# Altium schematic sheet euromap.SchDoc: EUROMAP interface
size A2; DrawnBy: Sergey Dytiuk (Ulysses); Engineer: Sergey Dytiuk; DocumentNumber: UCNC.01.00.001; SheetNumber: 1; SheetTotal: 1
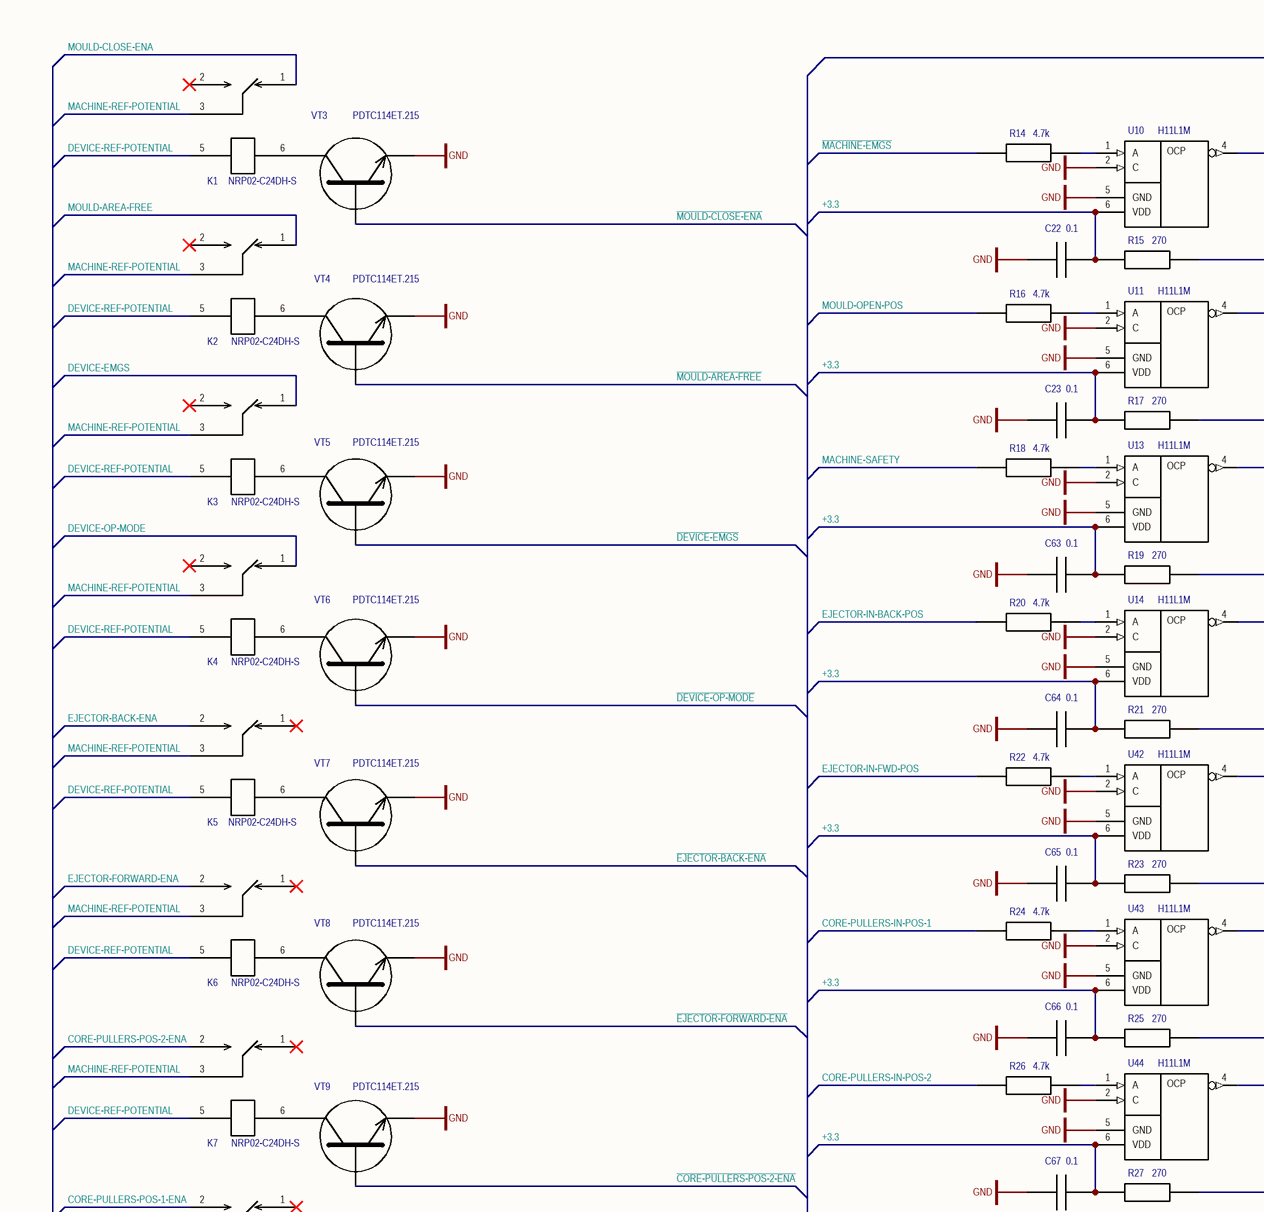
[diagram p0: euromap.SchDoc, top left]
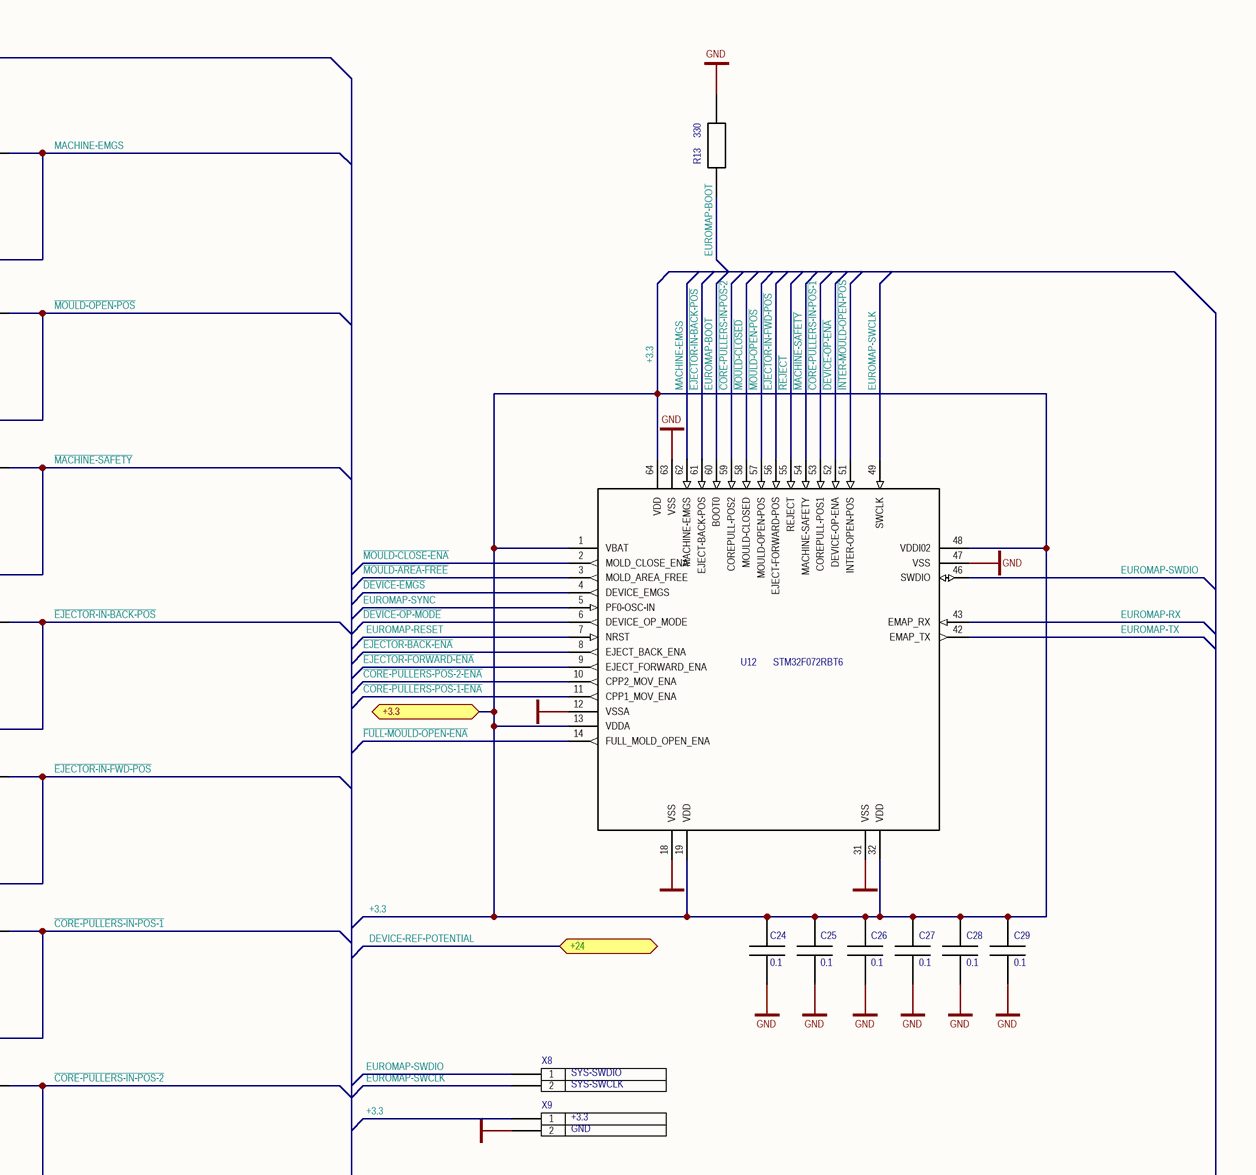
[diagram p1: euromap.SchDoc, top right]
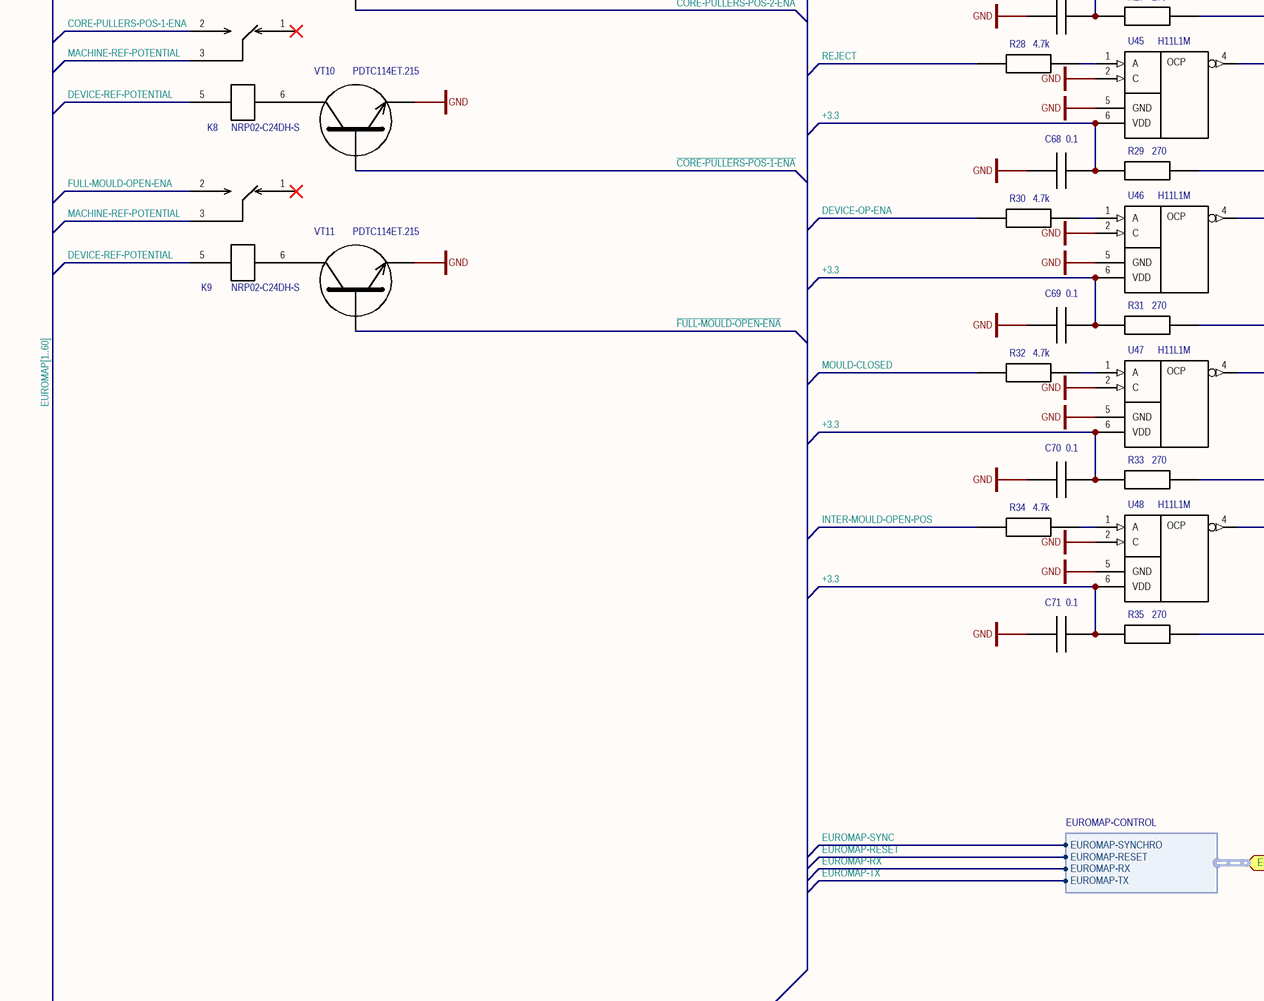
[diagram p2: euromap.SchDoc, bottom left]
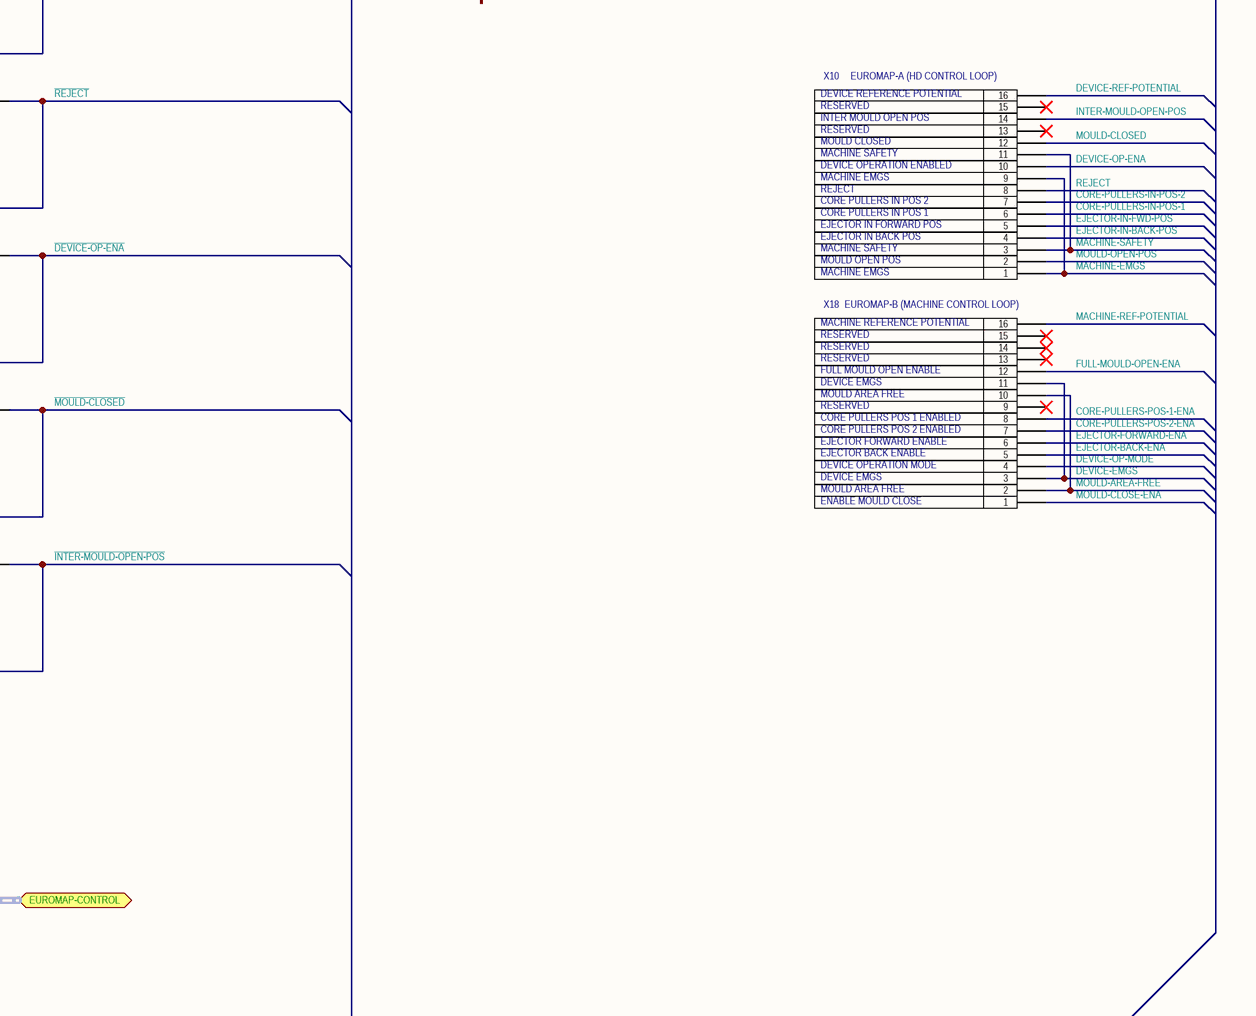
[diagram p3: euromap.SchDoc, bottom right]

## Parts
C22  0.1  [CAPC2012X04N]
C23  0.1  [CAPC2012X04N]
C24  0.1  [CAPC1608X05N]
C25  0.1  [CAPC1608X05N]
C26  0.1  [CAPC1608X05N]
C27  0.1  [CAPC1608X05N]
C28  0.1  [CAPC1608X05N]
C29  0.1  [CAPC1608X05N]
C63  0.1  [CAPC2012X04N]
C64  0.1  [CAPC2012X04N]
C65  0.1  [CAPC2012X04N]
C66  0.1  [CAPC2012X04N]
C67  0.1  [CAPC2012X04N]
C68  0.1  [CAPC2012X04N]
C69  0.1  [CAPC2012X04N]
C70  0.1  [CAPC2012X04N]
C71  0.1  [CAPC2012X04N]
K1  NRP02-C24DH-S  [R_NRP02]
K2  NRP02-C24DH-S  [R_NRP02]
K3  NRP02-C24DH-S  [R_NRP02]
K4  NRP02-C24DH-S  [R_NRP02]
K5  NRP02-C24DH-S  [R_NRP02]
K6  NRP02-C24DH-S  [R_NRP02]
K7  NRP02-C24DH-S  [R_NRP02]
K8  NRP02-C24DH-S  [R_NRP02]
K9  NRP02-C24DH-S  [R_NRP02]
R13  330  [RESC1608X05N]
R14  4.7k  [RESC2012X04N]
R15  270  [RESC2012X04N]
R16  4.7k  [RESC2012X04N]
R17  270  [RESC2012X04N]
R18  4.7k  [RESC2012X04N]
R19  270  [RESC2012X04N]
R20  4.7k  [RESC2012X04N]
R21  270  [RESC2012X04N]
R22  4.7k  [RESC2012X04N]
R23  270  [RESC2012X04N]
R24  4.7k  [RESC2012X04N]
R25  270  [RESC2012X04N]
R26  4.7k  [RESC2012X04N]
R27  270  [RESC2012X04N]
R28  4.7k  [RESC2012X04N]
R29  270  [RESC2012X04N]
R30  4.7k  [RESC2012X04N]
R31  270  [RESC2012X04N]
R32  4.7k  [RESC2012X04N]
R33  270  [RESC2012X04N]
R34  4.7k  [RESC2012X04N]
R35  270  [RESC2012X04N]
U10  H11L1M  [DIP6]
U11  H11L1M  [DIP6]
U12  STM32F072RBT6  [TSQFP50P1200X1200X160-64N]
U13  H11L1M  [DIP6]
U14  H11L1M  [DIP6]
U42  H11L1M  [DIP6]
U43  H11L1M  [DIP6]
U44  H11L1M  [DIP6]
U45  H11L1M  [DIP6]
U46  H11L1M  [DIP6]
U47  H11L1M  [DIP6]
U48  H11L1M  [DIP6]
VT3  PDTC114ET.215  [SOT95P238X102-3N]
VT4  PDTC114ET.215  [SOT95P238X102-3N]
VT5  PDTC114ET.215  [SOT95P238X102-3N]
VT6  PDTC114ET.215  [SOT95P238X102-3N]
VT7  PDTC114ET.215  [SOT95P238X102-3N]
VT8  PDTC114ET.215  [SOT95P238X102-3N]
VT9  PDTC114ET.215  [SOT95P238X102-3N]
VT10  PDTC114ET.215  [SOT95P238X102-3N]
VT11  PDTC114ET.215  [SOT95P238X102-3N]
X8  Jamper ZL201  [ZL201-2]  (value not drawn)
X9  Jamper ZL201  [ZL201-2]  (value not drawn)
X10  EUROMAP-A (HD CONTROL LOOP)  [MINI-FIT-16-WAY-M]
X18  EUROMAP-B (MACHINE CONTROL LOOP)  [MINI-FIT-16-WAY-M]

## Ports
+3.3, +24, EUROMAP-CONTROL (harness EUROMAP-CONTROL)

## Harnesses
EUROMAP-CONTROL: EUROMAP-SYNCHRO, EUROMAP-RESET, EUROMAP-RX, EUROMAP-TX

## Nets
GND: C22.1 C23.1 C24.1 C25.1 C26.1 C27.1 C28.1 C29.1 C63.1 C64.1 C65.1 C66.1 C67.1 C68.1 C69.1 C70.1 C71.1 R13.1 U10.2(C) U10.5(GND) U11.2(C) U11.5(GND) U12.12(VSSA) U12.18(VSS) U12.31(VSS) U12.47(VSS) U12.63(VSS) U13.2(C) U13.5(GND) U14.2(C) U14.5(GND) U42.2(C) U42.5(GND) U43.2(C) U43.5(GND) U44.2(C) U44.5(GND) U45.2(C) U45.5(GND) U46.2(C) U46.5(GND) U47.2(C) U47.5(GND) U48.2(C) U48.5(GND) VT3.2(E) VT4.2(E) VT5.2(E) VT6.2(E) VT7.2(E) VT8.2(E) VT9.2(E) VT10.2(E) VT11.2(E) X9.2
+3.3: C22.2 C23.2 C24.2 C25.2 C26.2 C27.2 C28.2 C29.2 C63.2 C64.2 C65.2 C66.2 C67.2 C68.2 C69.2 C70.2 C71.2 R15.1 R17.1 R19.1 R21.1 R23.1 R25.1 R27.1 R29.1 R31.1 R33.1 R35.1 U10.6(VDD) U11.6(VDD) U12.1(VBAT) U12.13(VDDA) U12.19(VDD) U12.32(VDD) U12.48(VDDI02) U12.64(VDD) U13.6(VDD) U14.6(VDD) U42.6(VDD) U43.6(VDD) U44.6(VDD) U45.6(VDD) U46.6(VDD) U47.6(VDD) U48.6(VDD) X9.1 ; port +3.3
~{CORE-PULLERS-IN-POS-1}: R25.2 U12.53(COREPULL-POS1) U43.4(OUT)
~{CORE-PULLERS-IN-POS-2}: R27.2 U12.59(COREPULL-POS2) U44.4(OUT)
~{CORE-PULLERS-POS-1-ENA}: U12.11(CPP1_MOV_ENA) VT10.1(B)
~{CORE-PULLERS-POS-2-ENA}: U12.10(CPP2_MOV_ENA) VT9.1(B)
CORE-PULLERS-IN-POS-1: R24.1 X10.6
CORE-PULLERS-IN-POS-2: R26.1 X10.7
CORE-PULLERS-POS-1-ENA: K8.2 X18.8
CORE-PULLERS-POS-2-ENA: K7.2 X18.7
~{DEVICE-EMGS}: U12.4(DEVICE_EMGS) VT5.1(B)
~{DEVICE-OP-ENA}: R31.2 U12.52(DEVICE-OP-ENA) U46.4(OUT)
~{DEVICE-OP-MODE}: U12.6(DEVICE_OP_MODE) VT6.1(B)
DEVICE-EMGS: K3.1 X18.3 X18.11
DEVICE-OP-ENA: R30.1 X10.10
DEVICE-OP-MODE: K4.1 X18.4
DEVICE-REF-POTENTIAL: K1.5 K2.5 K3.5 K4.5 K5.5 K6.5 K7.5 K8.5 K9.5 X10.16 ; port +24
~{EJECTOR-BACK-ENA}: U12.8(EJECT_BACK_ENA) VT7.1(B)
~{EJECTOR-FORWARD-ENA}: U12.9(EJECT_FORWARD_ENA) VT8.1(B)
~{EJECTOR-IN-BACK-POS}: R21.2 U12.61(EJECT-BACK-POS) U14.4(OUT)
~{EJECTOR-IN-FWD-POS}: R23.2 U12.56(EJECT-FORWARD-POS) U42.4(OUT)
EJECTOR-BACK-ENA: K5.2 X18.5
EJECTOR-FORWARD-ENA: K6.2 X18.6
EJECTOR-IN-BACK-POS: R20.1 X10.4
EJECTOR-IN-FWD-POS: R22.1 X10.5
EUROMAP-BOOT: R13.2 U12.60(BOOT0)
EUROMAP-RESET: U12.7(NRST) ; port EUROMAP-CONTROL.EUROMAP-RESET
EUROMAP-RX: U12.43(EMAP_RX) ; port EUROMAP-CONTROL.EUROMAP-RX
EUROMAP-SWCLK: U12.49(SWCLK) X8.2
EUROMAP-SWDIO: U12.46(SWDIO) X8.1
EUROMAP-SYNC: U12.5(PF0-OSC-IN) ; port EUROMAP-CONTROL.EUROMAP-SYNCHRO
EUROMAP-TX: U12.42(EMAP_TX) ; port EUROMAP-CONTROL.EUROMAP-TX
~{FULL-MOULD-OPEN-ENA}: U12.14(FULL_MOLD_OPEN_ENA) VT11.1(B)
FULL-MOULD-OPEN-ENA: K9.2 X18.12
~{INTER-MOULD-OPEN-POS}: R35.2 U12.51(INTER-OPEN-POS) U48.4(OUT)
INTER-MOULD-OPEN-POS: R34.1 X10.14
~{MACHINE-EMGS}: R14.1
~{MACHINE-SAFETY}: R19.2 U12.54(MACHINE-SAFETY) U13.4(OUT)
~{MOULD-AREA-FREE}: U12.3(MOLD_AREA_FREE) VT4.1(B)
~{MOULD-CLOSE-ENA}: U12.2(MOLD_CLOSE_ENA) VT3.1(B)
~{MOULD-CLOSED}: R33.2 U12.58(MOULD-CLOSED) U47.4(OUT)
~{MOULD-OPEN-POS}: R17.2 U11.4(OUT) U12.57(MOULD-OPEN-POS)
MACHINE-EMGS: R15.2 U10.4(OUT) U12.62(MACHINE-EMGS) X10.1 X10.9
MACHINE-REF-POTENTIAL: K1.3 K2.3 K3.3 K4.3 K5.3 K6.3 K7.3 K8.3 K9.3 X18.16
MACHINE-SAFETY: R18.1 X10.3 X10.11
MOULD-AREA-FREE: K2.1 X18.2 X18.10
MOULD-CLOSE-ENA: K1.1 X18.1
MOULD-CLOSED: R32.1 X10.12
MOULD-OPEN-POS: R16.1 X10.2
~{REJECT}: R29.2 U12.55(REJECT) U45.4(OUT)
REJECT: R28.1 X10.8
NetK1_6: K1.6 VT3.3(C)
NetK2_6: K2.6 VT4.3(C)
NetK3_6: K3.6 VT5.3(C)
NetK4_6: K4.6 VT6.3(C)
NetK5_6: K5.6 VT7.3(C)
NetK6_6: K6.6 VT8.3(C)
NetK7_6: K7.6 VT9.3(C)
NetK8_6: K8.6 VT10.3(C)
NetK9_6: K9.6 VT11.3(C)
NetR14_2: R14.2 U10.1(A)
NetR16_2: R16.2 U11.1(A)
NetR18_2: R18.2 U13.1(A)
NetR20_2: R20.2 U14.1(A)
NetR22_2: R22.2 U42.1(A)
NetR24_2: R24.2 U43.1(A)
NetR26_2: R26.2 U44.1(A)
NetR28_2: R28.2 U45.1(A)
NetR30_2: R30.2 U46.1(A)
NetR32_2: R32.2 U47.1(A)
NetR34_2: R34.2 U48.1(A)

Not connected (* = marked no-connect by the designer): K1 2*; K2 2*; K3 2*; K4 2*; K5 1*; K6 1*; K7 1*; K8 1*; K9 1*; U12 15(PA1) 16(PA2) 17(PA3) 20(PA4) 21(PA5) 22(PA6) 23(PA7) 24(PC4) 25(PC5) 26(PB0) 27(PB1) 28(PB2) 29(PB10) 30(PB11) 33(PB12) 34(PB13) 35(PB14) 36(PB15) 37(PC6) 38(PC7) 39(PC8) 40(PC9) 41(PA8) 44(PA11) 45(PA12) 50(PA15); X10 13* 15*; X18 9* 13* 14* 15*

## Buses and harness runs
bus EUROMAP[1..60]

## Notes on the sheet
- SYS-SWDIO
- SYS-SWCLK
- +3.3
- GND
- RESERVED
- INTER MOULD OPEN POS
- (near X10) DEVICE REFERENCE POTENTIAL
- MACHINE EMGS
- MACHINE SAFETY
- CORE PULLERS IN POS 2
- REJECT
- DEVICE OPERATION ENABLED
- MOULD CLOSED
- MOULD OPEN POS
- EJECTOR IN BACK POS
- EJECTOR IN FORWARD POS
- CORE PULLERS IN POS 1
- MACHINE REFERENCE POTENTIAL
- MOULD AREA FREE
- DEVICE EMGS
- (near X18) CORE PULLERS POS 2 ENABLED
- (near X18) CORE PULLERS POS 1 ENABLED
- FULL MOULD OPEN ENABLE
- ENABLE MOULD CLOSE
- DEVICE OPERATION MODE
- EJECTOR BACK ENABLE
- EJECTOR FORWARD ENABLE
- (in symbol H11L1M) OCP

## Library data of the parts
C22-C29 C63-C71 = C: SMD конденсатор; Ref: http://www.kosmodrom.com.ua/prodlist.php?name=cap1206
K1-K9 = NRP02-C24DH-S: Электромеханическое реле
R13-R35 = R: SMD резистор; Ref: http://www.kosmodrom.com.ua/prodlist.php?name=res1206
U10 U11 U13 U14 U42-U48 = H11L1M: Fairchild H11L1M Schmitt Trigger Output Optocoupler; Ref: http://www.kosmodrom.com.ua/el.php?name=H11L1M
U12 = STM32F072RBT6: Микроконтроллер
VT3-VT11 = PDTC114ET.215: NPN transistor with bias circuit
X10 X18 = MINI-FIT-16-WAY-M